# EAGLE design HVcontroller0_1 (EAGLE 6.5.0)

## Sheet 1 of 2: Processor/Controls
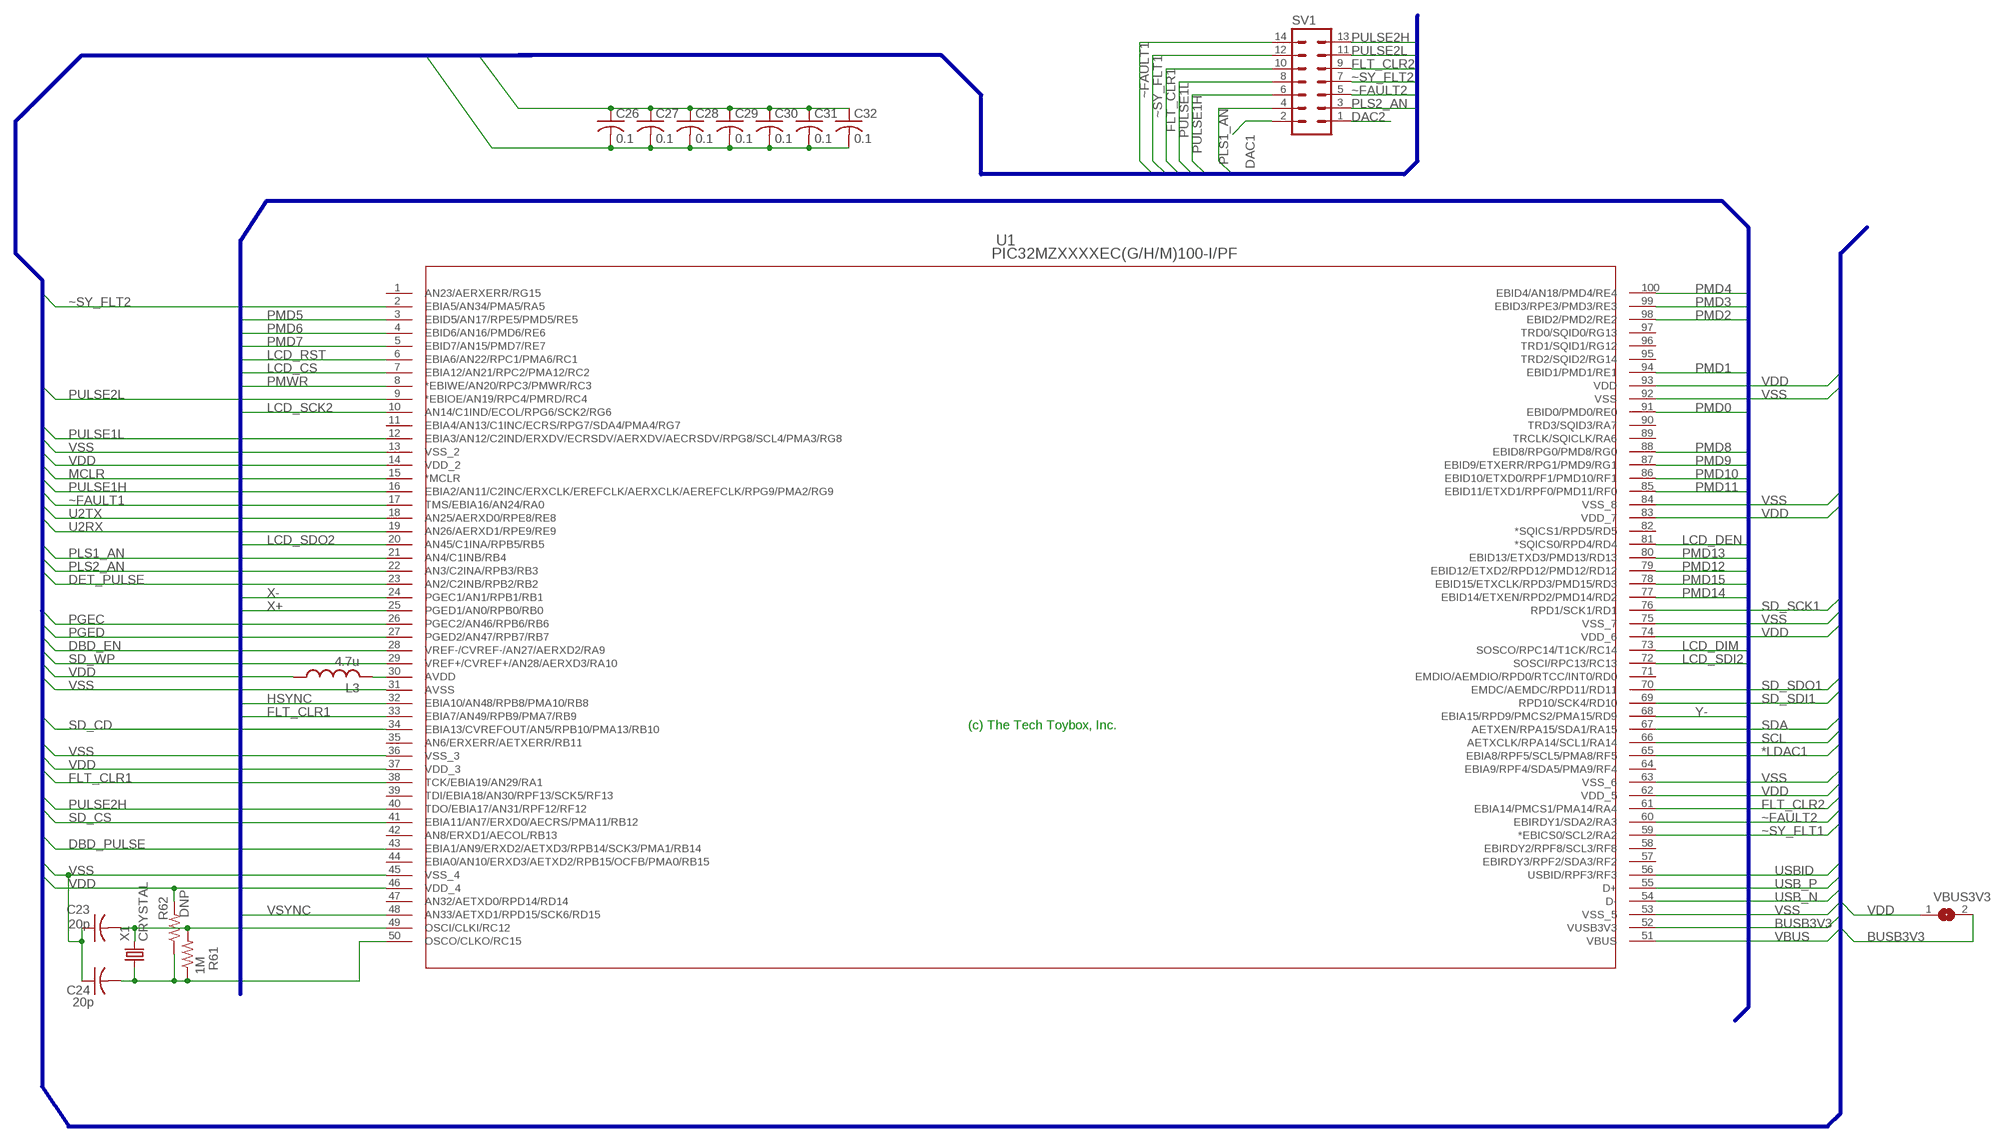
[diagram p0: schematic, sheet 1]

### Parts
C23  20p  C-USC0402  [C0402]
C24  20p  C-USC0402  [C0402]
C26  0.1  C-USC0603  [C0603]
C27  0.1  C-USC0603  [C0603]
C28  0.1  C-USC0603  [C0603]
C29  0.1  C-USC0603  [C0603]
C30  0.1  C-USC0603  [C0603]
C31  0.1  C-USC0603  [C0603]
C32  0.1  C-USC0603  [C0603]
L3  4.7u  L-USL2012C  [L2012C]
R61  1M  R-US_R0402  [R0402]
R62  DNP  R-US_R0402  [R0402]
SV1  MA07-2  [MA07-2]
U1  PIC32MZXXXXEC(G/H/M)100-I/PF  [TQFP100_14X14MC]
VBUS3V3  SJ  [SJ]
X1  CRYSTAL  [ABM]

### Nets
*LDAC1: U1.65(EBIA8/RPF5/SCL5/PMA8/RF5) ; also sheet 2
BUSB3V3: U1.52(VUSB3V3) VBUS3V3.2
DAC1: SV1.2 ; also sheet 2
DAC2: SV1.1 ; also sheet 2
DBD_EN: U1.28(VREF-/CVREF-/AN27/AERXD2/RA9)
DBD_PULSE: U1.43(EBIA1/AN9/ERXD2/AETXD3/RPB14/SCK3/PMA1/RB14)
DET_PULSE: U1.23(AN2/C2INB/RPB2/RB2) ; also sheet 2
FLT_CLR1: SV1.10 U1.38(TCK/EBIA19/AN29/RA1)
FLT_CLR2: SV1.9 U1.61(EBIA14/PMCS1/PMA14/RA4)
HSYNC: U1.32(EBIA10/AN48/RPB8/PMA10/RB8)
LCD_CS: U1.7(EBIA12/AN21/RPC2/PMA12/RC2)
LCD_DEN: U1.81(*SQICS0/RPD4/RD4)
LCD_DIM: U1.73(SOSCO/RPC14/T1CK/RC14)
LCD_RST: U1.6(EBIA6/AN22/RPC1/PMA6/RC1)
LCD_SCK2: U1.10(AN14/C1IND/ECOL/RPG6/SCK2/RG6)
LCD_SDI2: U1.72(SOSCI/RPC13/RC13)
LCD_SDO2: U1.20(AN45/C1INA/RPB5/RB5)
MCLR: U1.15(*MCLR) ; also sheet 2
N$93: L3.2 U1.30(AVDD)
N$107: C23.2 R61.2 U1.49(OSCI/CLKI/RC12) X1.P$2
N$108: C24.2 R61.1 R62.1 U1.50(OSCO/CLKO/RC15) X1.P$1
PGEC: U1.26(PGEC2/AN46/RPB6/RB6) ; also sheet 2
PGED: U1.27(PGED2/AN47/RPB7/RB7) ; also sheet 2
PLS1_AN: SV1.4 U1.21(AN4/C1INB/RB4)
PLS2_AN: SV1.3 U1.22(AN3/C2INA/RPB3/RB3)
PMD0: U1.91(EBID0/PMD0/RE0)
PMD1: U1.94(EBID1/PMD1/RE1)
PMD2: U1.98(EBID2/PMD2/RE2)
PMD3: U1.99(EBID3/RPE3/PMD3/RE3)
PMD4: U1.100(EBID4/AN18/PMD4/RE4)
PMD5: U1.3(EBID5/AN17/RPE5/PMD5/RE5)
PMD6: U1.4(EBID6/AN16/PMD6/RE6)
PMD7: U1.5(EBID7/AN15/PMD7/RE7)
PMD8: U1.88(EBID8/RPG0/PMD8/RG0)
PMD9: U1.87(EBID9/ETXERR/RPG1/PMD9/RG1)
PMD10: U1.86(EBID10/ETXD0/RPF1/PMD10/RF1)
PMD11: U1.85(EBID11/ETXD1/RPF0/PMD11/RF0)
PMD12: U1.79(EBID12/ETXD2/RPD12/PMD12/RD12)
PMD13: U1.80(EBID13/ETXD3/PMD13/RD13)
PMD14: U1.77(EBID14/ETXEN/RPD2/PMD14/RD2)
PMD15: U1.78(EBID15/ETXCLK/RPD3/PMD15/RD3)
PMWR: U1.8(*EBIWE/AN20/RPC3/PMWR/RC3)
PULSE1H: SV1.6 U1.16(EBIA2/AN11/C2INC/ERXCLK/EREFCLK/AERXCLK/AEREFCLK/RPG9/PMA2/RG9)
PULSE1L: SV1.8 U1.12(EBIA3/AN12/C2IND/ERXDV/ECRSDV/AERXDV/AECRSDV/RPG8/SCL4/PMA3/RG8)
PULSE2H: SV1.13 U1.40(TDO/EBIA17/AN31/RPF12/RF12)
PULSE2L: SV1.11 U1.9(*EBIOE/AN19/RPC4/PMRD/RC4)
SCL: U1.66(AETXCLK/RPA14/SCL1/RA14) ; also sheet 2
SD_CD: U1.34(EBIA13/CVREFOUT/AN5/RPB10/PMA13/RB10) ; also sheet 2
SD_CS: U1.41(EBIA11/AN7/ERXD0/AECRS/PMA11/RB12) ; also sheet 2
SD_SCK1: U1.76(RPD1/SCK1/RD1) ; also sheet 2
SD_SDI1: U1.69(RPD10/SCK4/RD10) ; also sheet 2
SD_SDO1: U1.70(EMDC/AEMDC/RPD11/RD11) ; also sheet 2
SD_WP: U1.29(VREF+/CVREF+/AN28/AERXD3/RA10) ; also sheet 2
SDA: U1.67(AETXEN/RPA15/SDA1/RA15) ; also sheet 2
U2RX: U1.19(AN26/AERXD1/RPE9/RE9) ; also sheet 2
U2TX: U1.18(AN25/AERXD0/RPE8/RE8) ; also sheet 2
USB_N: U1.54(D-) ; also sheet 2
USB_P: U1.55(D+) ; also sheet 2
USBID: U1.56(USBID/RPF3/RF3) ; also sheet 2
VBUS: U1.51(VBUS) ; also sheet 2
VDD: C26.1 C27.1 C28.1 C29.1 C30.1 C31.1 C32.1 L3.1 R62.2 U1.14(VDD_2) U1.37(VDD_3) U1.46(VDD_4) U1.62(VDD_5) U1.74(VDD_6) U1.83(VDD_7) U1.93(VDD) VBUS3V3.1 ; also sheet 2
VSS: C23.1 C24.1 C26.2 C27.2 C28.2 C29.2 C30.2 C31.2 C32.2 U1.13(VSS_2) U1.31(AVSS) U1.36(VSS_3) U1.45(VSS_4) U1.53(VSS_5) U1.63(VSS_6) U1.75(VSS_7) U1.84(VSS_8) U1.92(VSS) ; also sheet 2
VSYNC: U1.48(AN33/AETXD1/RPD15/SCK6/RD15)
X+: U1.25(PGED1/AN0/RPB0/RB0)
X-: U1.24(PGEC1/AN1/RPB1/RB1)
Y+: U1.33(EBIA7/AN49/RPB9/PMA7/RB9)
Y-: U1.68(EBIA15/RPD9/PMCS2/PMA15/RD9)
~FAULT1: SV1.14 U1.17(TMS/EBIA16/AN24/RA0)
~FAULT2: SV1.5 U1.60(EBIRDY1/SDA2/RA3)
~SY_FLT1: SV1.12 U1.59(*EBICS0/SCL2/RA2)
~SY_FLT2: SV1.7 U1.2(EBIA5/AN34/PMA5/RA5)
Unconnected: U1.1(AN23/AERXERR/RG15) U1.11(EBIA4/AN13/C1INC/ECRS/RPG7/SDA4/PMA4/RG7) U1.35(AN6/ERXERR/AETXERR/RB11) U1.39(TDI/EBIA18/AN30/RPF13/SCK5/RF13) U1.42(AN8/ERXD1/AECOL/RB13) U1.44(EBIA0/AN10/ERXD3/AETXD2/RPB15/OCFB/PMA0/RB15) U1.47(AN32/AETXD0/RPD14/RD14) U1.57(EBIRDY3/RPF2/SDA3/RF2) U1.58(EBIRDY2/RPF8/SCL3/RF8) U1.64(EBIA9/RPF4/SDA5/PMA9/RF4) U1.71(EMDIO/AEMDIO/RPD0/RTCC/INT0/RD0) U1.82(*SQICS1/RPD5/RD5) U1.89(TRCLK/SQICLK/RA6) U1.90(TRD3/SQID3/RA7) U1.95(TRD2/SQID2/RG14) U1.96(TRD1/SQID1/RG12) U1.97(TRD0/SQID0/RG13)

### Buses
PULSE1H,PULSE1L,~FAULT1,~SY_FLT1,FLT_CLR1,PLS1_AN,PULSE2H,PULSE2L,~FAULT2,~SY_FLT2,FLT_CLR2,PLS2_AN,SCL,SDA,*LDAC1,RDY1,DBD_EN,DBD_PULSE,DBD_AN,MCLR,PGED,PGEC,USB_N,USB_P,VBUS,BUSB3V3,USBID,U2TX,U2RX,DET_PULSE,SD_WP,SD_CS,SD_SDI1,SD_SDO1,SD_SCK1,SD_CD,VDD,VSS
PMD[0..15],LCD_DEN,LCD_DIM,Y+,Y-,X+,X-,HSYNC,VSYNC,LCD_SDI2,LCD_SDO2,LCD_SCK2,LCD_RST,LCD_CS,PMWR

### Notes on the sheet
- (c) The Tech Toybox, Inc.

## Sheet 2 of 2
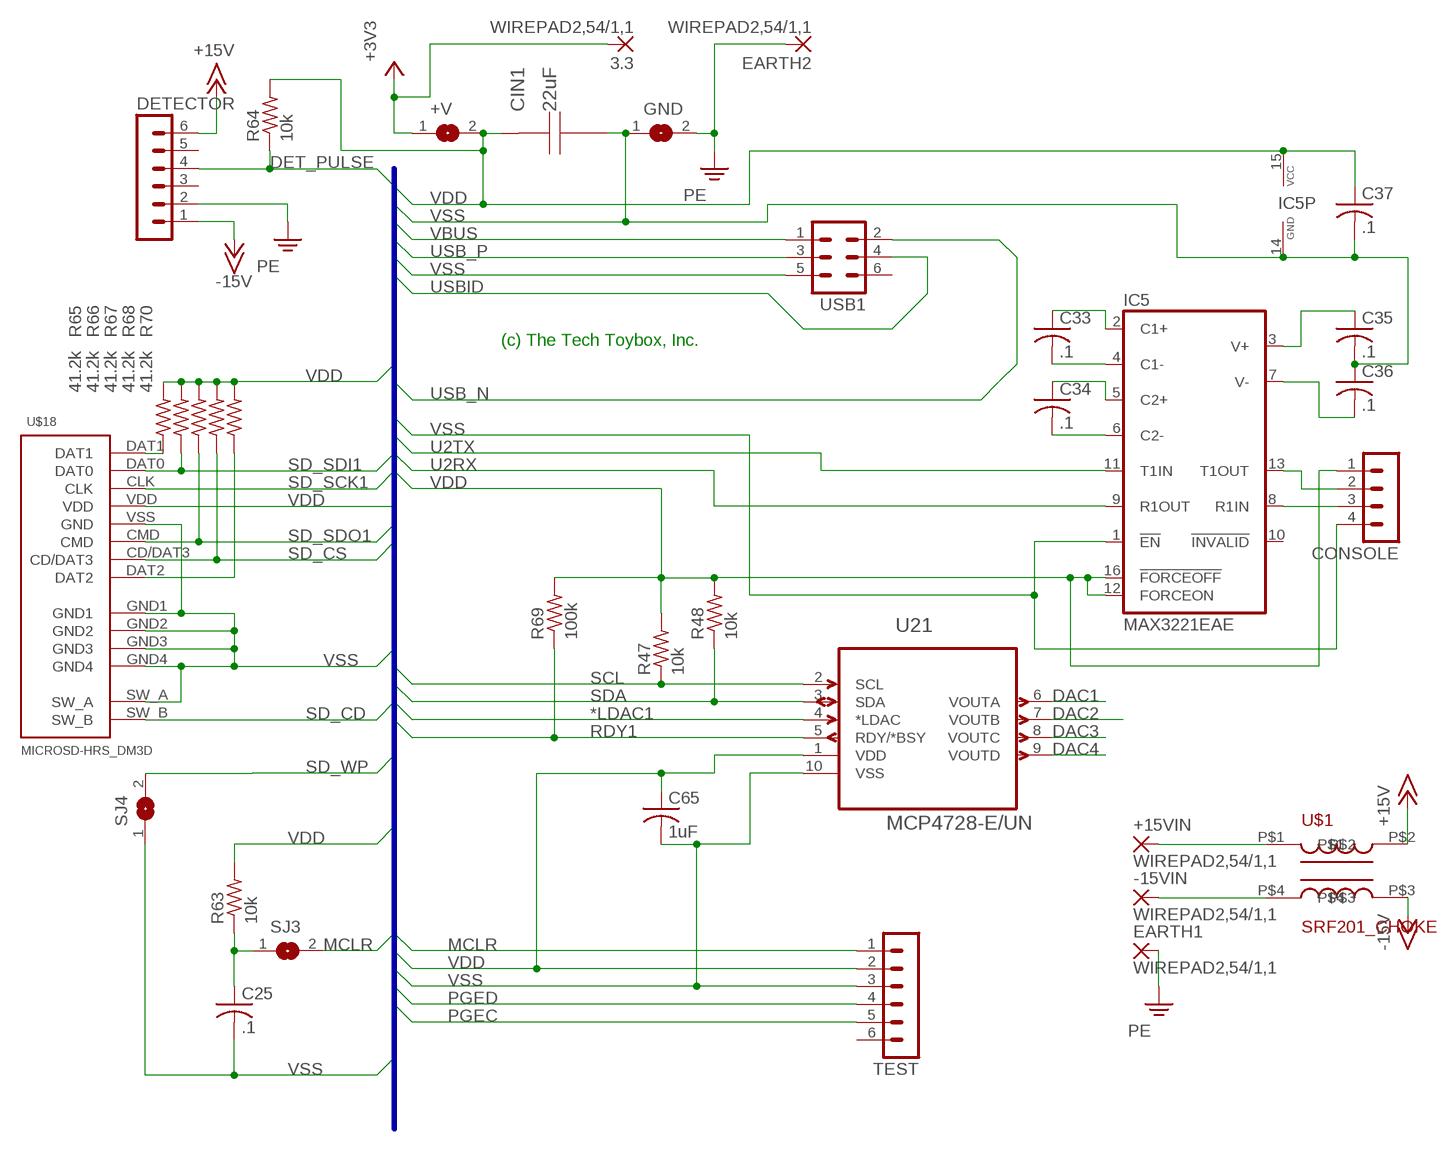
[diagram p1: schematic, sheet 2]

### Parts
3.3  WIREPAD2,54/1,1  [2,54/1,1]
+15VIN  WIREPAD2,54/1,1  [2,54/1,1]
+V  SJW  [SJW]
-15VIN  WIREPAD2,54/1,1  [2,54/1,1]
C25  .1  C-USC0402  [C0402]
C33  .1  C-USC0402  [C0402]
C34  .1  C-USC0402  [C0402]
C35  .1  C-USC0402  [C0402]
C36  .1  C-USC0402  [C0402]
C37  .1  C-USC0402  [C0402]
C65  1uF  C-USC0402  [C0402]
CIN1  22uF  GRM32ER61E226KE15L  [1210]
CONSOLE  MA04-1  [MA04-1]
DETECTOR  MA06-1  [MA06-1]
EARTH1  WIREPAD2,54/1,1  [2,54/1,1]
EARTH2  WIREPAD2,54/1,1  [2,54/1,1]
GND  SJW  [SJW]
IC5  MAX3221EAE  [SSOP16]
R47  10k  R-US_R0805  [R0805]
R48  10k  R-US_R0805  [R0805]
R63  10k  R-US_R0805  [R0805]
R64  10k  R-US_R0805  [R0805]
R65  41.2k  R-US_R0603  [R0603]
R66  41.2k  R-US_R0603  [R0603]
R67  41.2k  R-US_R0603  [R0603]
R68  41.2k  R-US_R0603  [R0603]
R69  100k  R-US_R0805  [R0805]
R70  41.2k  R-US_R0603  [R0603]
SJ3  SJ  [SJ]
SJ4  SJ  [SJ]
TEST  MA06-1  [MA06-1]
U21  MCP4728-E/UN  [SOP50P490X110-10N]
U$1  SRF201_CHOKE  [CHOKE_BOURNES_SRF2012]
U$18  MICROSD-HRS_DM3D  [DM3D]
USB1  MA03-2  [MA03-2]

### Nets
*LDAC1: U21.4(*LDAC) ; also sheet 1
+3V3: 3.3.1(P) +V.1
+15V: DETECTOR.6 U$1.P$2
-15V: DETECTOR.1 U$1.P$3
DAC1: U21.6(VOUTA) ; also sheet 1
DAC2: U21.7(VOUTB) ; also sheet 1
DAC3: U21.8(VOUTC)
DAC4: U21.9(VOUTD)
DET_PULSE: DETECTOR.4 R64.1 ; also sheet 1
MCLR: SJ3.2 TEST.1 ; also sheet 1
N$1: -15VIN.1(P) U$1.P$4
N$2: +15VIN.1(P) U$1.P$1
N$28: R65.1 U$18.DAT1
N$49: R70.1 U$18.DAT2
N$92: C33.1 IC5.2(C1+)
N$102: C25.1 R63.1 SJ3.1
N$109: C33.2 IC5.4(C1-)
N$110: C34.1 IC5.5(C2+)
N$111: C34.2 IC5.6(C2-)
N$112: C35.1 IC5.3(V+)
N$113: C36.2 IC5.7(V-)
N$116: CONSOLE.2 IC5.13(T1OUT)
N$117: CONSOLE.3 IC5.8(R1IN)
PE: DETECTOR.2 EARTH1.1(P) EARTH2.1(P) GND.2
PGEC: TEST.5 ; also sheet 1
PGED: TEST.4 ; also sheet 1
RDY1: R69.1 U21.5(RDY/*BSY)
SCL: R47.1 U21.2(SCL) ; also sheet 1
SD_CD: U$18.SW_B ; also sheet 1
SD_CS: R68.1 U$18.CD/DAT3 ; also sheet 1
SD_SCK1: U$18.CLK ; also sheet 1
SD_SDI1: R66.1 U$18.DAT0 ; also sheet 1
SD_SDO1: R67.1 U$18.CMD ; also sheet 1
SD_WP: SJ4.2 ; also sheet 1
SDA: R48.1 U21.3(SDA) ; also sheet 1
U2RX: IC5.9(R1OUT) ; also sheet 1
U2TX: IC5.11(T1IN) ; also sheet 1
USB_N: USB1.2 ; also sheet 1
USB_P: USB1.3 ; also sheet 1
USBID: USB1.4 ; also sheet 1
VBUS: USB1.1 ; also sheet 1
VDD: +V.2 C37.1 C65.1 CIN1.1 CONSOLE.1 IC5.12(FORCEON) IC5.15(VCC) IC5.16(!FORCEOFF) R47.2 R48.2 R63.2 R64.2 R65.2 R66.2 R67.2 R68.2 R69.2 R70.2 TEST.2 U21.1(VDD) U$18.VDD ; also sheet 1
VSS: C25.2 C35.2 C36.1 C37.2 C65.2 CIN1.2 CONSOLE.4 GND.1 IC5.1(!EN) IC5.14(GND) SJ4.1 TEST.3 U21.10(VSS) U$18.GND1 U$18.GND2 U$18.GND3 U$18.GND4 U$18.SW_A U$18.VSS(GND) USB1.5 ; also sheet 1
Unconnected: DETECTOR.3 DETECTOR.5 IC5.10(!INVALID) TEST.6 USB1.6

### Buses
PULSE1H,PULSE1L,~FAULT1,~SY_FLT1,FLT_CLR1,PLS1_AN,PULSE2H,PULSE2L,~FAULT2,~SY_FLT2,FLT_CLR2,PLS2_AN,SCL,SDA,*LDAC1,RDY1,DBD_EN,DBD_PULSE,DBD_AN,MCLR,PGED,PGEC,USB_N,USB_P,VBUS,BUSB3V3,USBID,U2TX,U2RX,DET_PULSE,SD_WP,SD_CS,SD_SDI1,SD_SDO1,SD_SCK1,SD_CD,VDD,VSS

### Notes on the sheet
- (c) The Tech Toybox, Inc.

## Library data of the parts
3.3 +15VIN -15VIN EARTH1 EARTH2 = wirepad:WIREPAD: Wire PAD connect wire on PCB
+V GND SJ3 SJ4 VBUS3V3 = jumper:SJ: SMD solder JUMPER
C23-C37 C65 = rcl:C-US: CAPACITOR, American symbol
CIN1 = workbookdesign0823:GRM32ER61E226KE15L; CAP: 2.2E-5; ESR: 0.0020; IRMS: 0.0; MANUFACTURER_NAME: MuRata; MANUFACTURER_PART_NUMBER: GRM32ER61E226KE15L; VDC: 25.0; VENDOR: MuRata
CONSOLE = UserMark (mark-Hi-Fi-A85W's conflicted copy 2016-02-01):MA04-1: PIN HEADER; OC_FARNELL: unknown; OC_NEWARK: unknown
DETECTOR TEST = UserMark (mark-Hi-Fi-A85W's conflicted copy 2016-02-01):MA06-1: PIN HEADER; OC_FARNELL: unknown; OC_NEWARK: unknown
IC5 = maxim:MAX3221*: RS-232 Transceivers with AutoShutdown 1µA Supply-Current, True +3V to +5.5V http://dbserv.maxim-ic.com/; MF: MAXIM; MPN: MAX3221EAE+; OC_FARNELL: 9725440; OC_NEWARK: 68K4609
L3 = rcl:L-US: INDUCTOR, American symbol
R47 R48 R61-R70 = rcl:R-US_: RESISTOR, American symbol
SV1 = UserMark:MA07-2: PIN HEADER; OC_FARNELL: unknown; OC_NEWARK: unknown
U1 = UserMark:PIC32MZXXXXEC(G/H/M)100-I/PF; MANUFACTURER_PART_NUMBER: pic32mz1024ecg100-i/pf; VENDOR: Microchip
U21 = Microchip_By_element14_Batch_1:MCP4728-E/UN: IC, DAC, 12BIT, QUAD; MPN: MCP4728-E/UN; OC_FARNELL: 1800217; OC_NEWARK: 08R1808; PACKAGE: MSOP-10; SUPPLIER: MICROCHIP
U$1 = UserMark:SRF201_CHOKE
U$18 = hrs_DM3D-SF:MICROSD-HRS_DM3D
USB1 = UserMark:MA03-2: PIN HEADER; OC_FARNELL: unknown; OC_NEWARK: unknown
X1 = UserMark:CRYSTAL

## Board
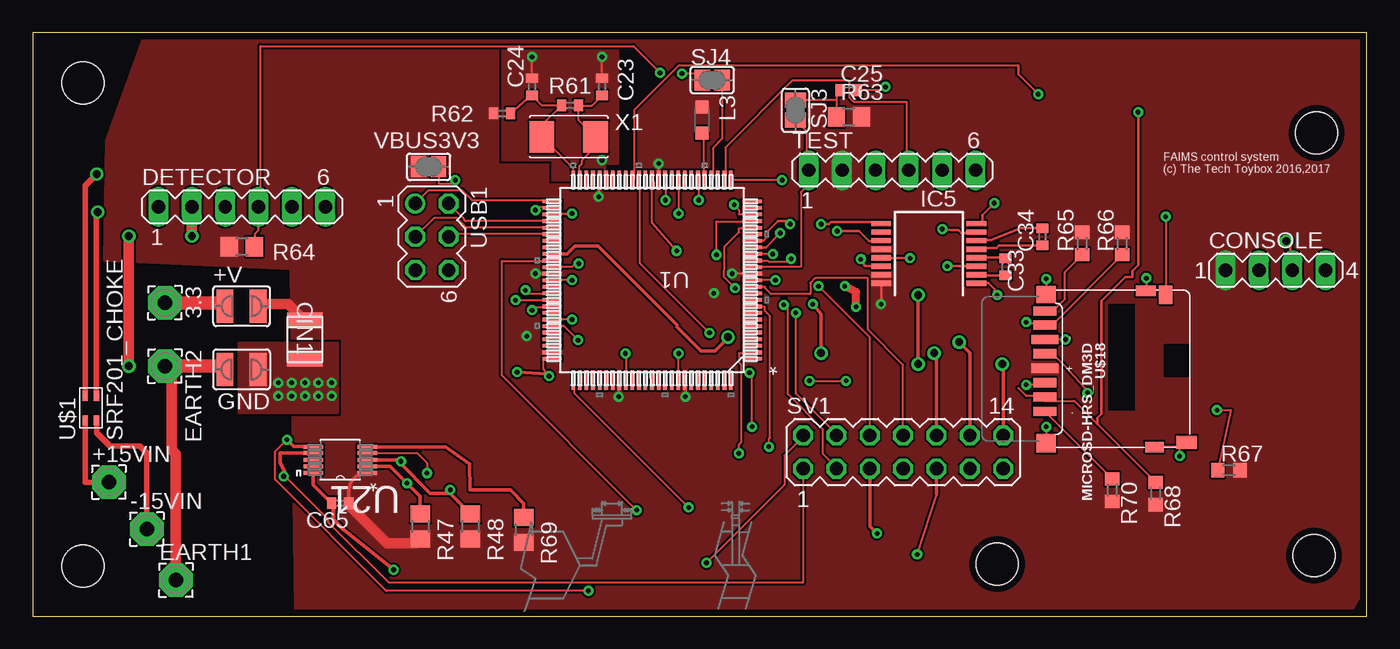
[diagram p2: board, top side]
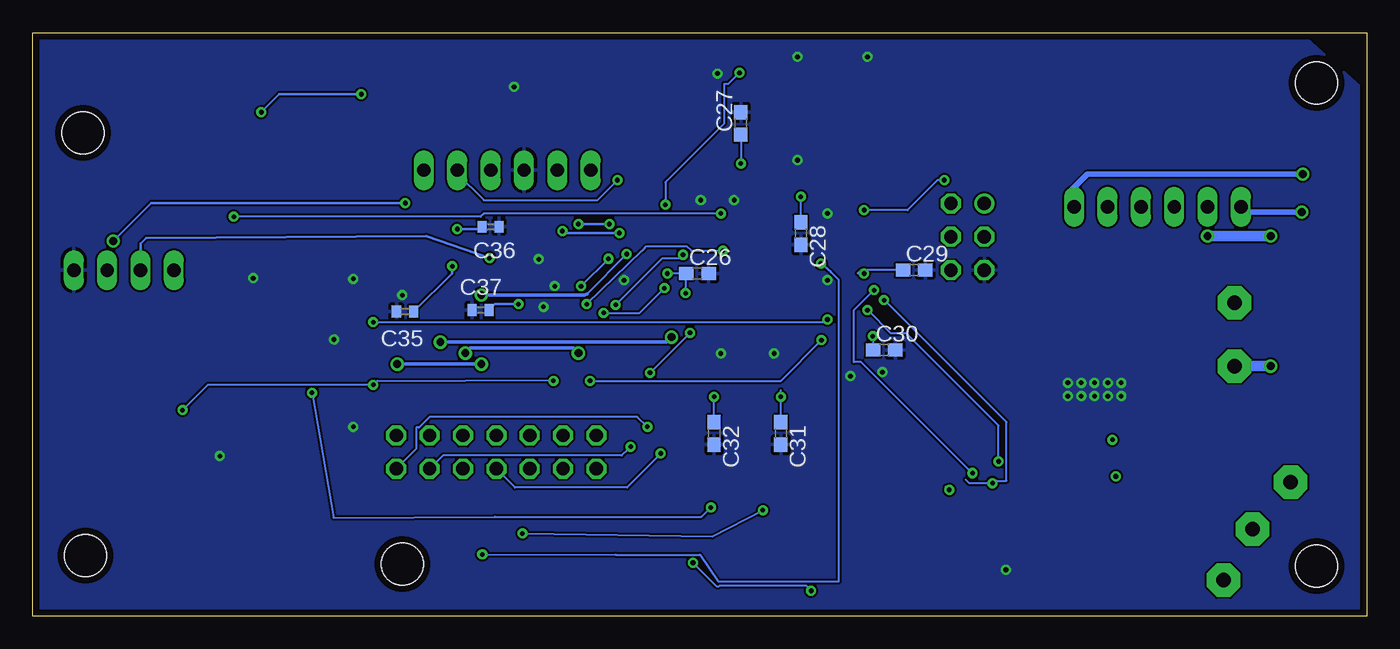
[diagram p3: board, bottom side, seen from below]

Size 101.6 x 44.45 mm. Coordinates in mm from the lower left corner, seen from the top.
Outline: 0,0 101.6,0 101.6,44.45 0,44.45 0,0
Copper layers (1*16): Top 0.0178mm / dielectric 59mil / Bottom 0.0178mm
Design rules "SSC-EAGLE-2Lyr_v1.0.0.3": minimum track width 6mil, minimum drill 14mil, track to track 6mil, track to pad 6mil, pad to pad 6mil, via to via 6mil, smd to smd 6mil, copper to edge 20mil, drill to drill 16mil, minimum pad ring 8mil, minimum via ring 8mil, stop-mask expansion 3mil, vias tented up to drill 0mil, thermal gap 10mil
Holes 3.2 mm at 3.81,40.64 3.81,3.81 97.79,36.83 73.46,3.96 97.59,4.62

### Footprints (pad centres in the part's own frame; a part is rotated, then mirrored left to right if it is on the bottom)
2,54/1,1 = drill 1.118 pad 2.54 octagon: 1 0,0
SJW = smd 1.27 x 2.54: 1 -1.27,0; 2 1.27,0
C0402 = smd 0.7 x 0.9: 1 -0.65,0; 2 0.65,0
C0603 = smd 1.1 x 1: 1 -0.85,0; 2 0.85,0
1210 = smd 1.118 x 2.692: 1 -1.499,0; 2 1.499,0
MA04-1 = drill 1.016 long: 1 -3.81,0; 2 -1.27,0; 3 1.27,0; 4 3.81,0
MA06-1 = drill 1.016 long: 1 -6.35,0; 2 -3.81,0; 3 -1.27,0; 4 1.27,0; 5 3.81,0; 6 6.35,0
SSOP16 = smd 0.4 x 1.5: 1 -2.275,-3.625; 2 -1.625,-3.625; 3 -0.975,-3.625; 4 -0.325,-3.625; 5 0.325,-3.625; 6 0.975,-3.625; 7 1.625,-3.625; 8 2.275,-3.625; 9 2.275,3.625; 10 1.625,3.625; 11 0.975,3.625; 12 0.325,3.625; 13 -0.325,3.625; 14 -0.975,3.625; 15 -1.625,3.625; 16 -2.275,3.625
L2012C = smd 1 x 1: 1 -1,0; 2 1,0
R0805 = smd 1.3 x 1.5: 1 -0.95,0; 2 0.95,0
R0402 = smd 0.7 x 0.9: 1 -0.65,0; 2 0.65,0
R0603 = smd 1 x 1.1: 1 -0.85,0; 2 0.85,0
SJ = smd 1.168 x 1.6: 1 -0.762,0; 2 0.762,0
MA07-2 = drill 1.016 octagon: 1 -7.62,-1.27; 2 -7.62,1.27; 3 -5.08,-1.27; 4 -5.08,1.27; 5 -2.54,-1.27; 6 -2.54,1.27; 7 0,-1.27; 8 0,1.27; 9 2.54,-1.27; 10 2.54,1.27; 11 5.08,-1.27; 12 5.08,1.27; 13 7.62,-1.27; 14 7.62,1.27
TQFP100_14X14MC = smd 1.473 x 0.279: 1 -7.62,5.994; 2 -7.62,5.512; 3 -7.62,5.004; 4 -7.62,4.496; 5 -7.62,3.988; 6 -7.62,3.505; 7 -7.62,2.997; 8 -7.62,2.489; 9 -7.62,2.007; 10 -7.62,1.499; 11 -7.62,0.991; 12 -7.62,0.508; 13 -7.62,0; 14 -7.62,-0.508; 15 -7.62,-0.991; 16 -7.62,-1.499; 17 -7.62,-2.007; 18 -7.62,-2.489; 19 -7.62,-2.997; 20 -7.62,-3.505; 21 -7.62,-3.988; 22 -7.62,-4.496; 23 -7.62,-5.004; 24 -7.62,-5.512; 25 -7.62,-5.994; 51 7.62,-5.994; 52 7.62,-5.512; 53 7.62,-5.004; 54 7.62,-4.496; 55 7.62,-3.988; 56 7.62,-3.505; 57 7.62,-2.997; 58 7.62,-2.489; 59 7.62,-2.007; 60 7.62,-1.499; 61 7.62,-0.991; 62 7.62,-0.508; 63 7.62,0; 64 7.62,0.508; 65 7.62,0.991; 66 7.62,1.499; 67 7.62,2.007; 68 7.62,2.489; 69 7.62,2.997; 70 7.62,3.505; 71 7.62,3.988; 72 7.62,4.496; 73 7.62,5.004; 74 7.62,5.512; 75 7.62,5.994 | smd 0.279 x 1.473: 26 -5.994,-7.62; 27 -5.512,-7.62; 28 -5.004,-7.62; 29 -4.496,-7.62; 30 -3.988,-7.62; 31 -3.505,-7.62; 32 -2.997,-7.62; 33 -2.489,-7.62; 34 -2.007,-7.62; 35 -1.499,-7.62; 36 -0.991,-7.62; 37 -0.508,-7.62; 38 0,-7.62; 39 0.508,-7.62; 40 0.991,-7.62; 41 1.499,-7.62; 42 2.007,-7.62; 43 2.489,-7.62; 44 2.997,-7.62; 45 3.505,-7.62; 46 3.988,-7.62; 47 4.496,-7.62; 48 5.004,-7.62; 49 5.512,-7.62; 50 5.994,-7.62; 76 5.994,7.62; 77 5.512,7.62; 78 5.004,7.62; 79 4.496,7.62; 80 3.988,7.62; 81 3.505,7.62; 82 2.997,7.62; 83 2.489,7.62; 84 2.007,7.62; 85 1.499,7.62; 86 0.991,7.62; 87 0.508,7.62; 88 0,7.62; 89 -0.508,7.62; 90 -0.991,7.62; 91 -1.499,7.62; 92 -2.007,7.62; 93 -2.489,7.62; 94 -2.997,7.62; 95 -3.505,7.62; 96 -3.988,7.62; 97 -4.496,7.62; 98 -5.004,7.62; 99 -5.512,7.62; 100 -5.994,7.62
SOP50P490X110-10N = smd 1.499 x 0.305: 1 -2.057,0.991; 2 -2.057,0.508; 3 -2.057,0; 4 -2.057,-0.508; 5 -2.057,-0.991; 6 2.057,-0.991; 7 2.057,-0.508; 8 2.057,0; 9 2.057,0.508; 10 2.057,0.991
CHOKE_BOURNES_SRF2012 = smd 0.749 x 0.394: P$1 -0.922,0.427; P$2 0.922,0.427; P$3 0.922,-0.427; P$4 -0.922,-0.427
DM3D = smd 0.7 x 1.75: CD/DAT3 8.15,0.45; CLK 4.85,0.45; CMD 7.05,0.45; DAT0 2.65,0.45; DAT1 1.6,0.45; DAT2 9.25,0.45 | smd 0.8 x 1.5: GND1 0.05,8.15 | smd 0.8 x 1.4: GND2 11.95,8.8 | smd 1.4 x 1.5: GND3 11.65,0.55 | smd 1.3 x 1.5: GND4 0.35,0.55 | smd 1 x 1.55: SW_A 11.6,11.25 | smd 1.4 x 1: SW_B 0.35,9.65 | smd 0.7 x 2.032: VDD 5.95,0.45; VSS 3.75,0.45
MA03-2 = drill 1.016: 1 -2.54,-1.27 | drill 1.016 octagon: 2 -2.54,1.27; 3 0,-1.27; 4 0,1.27; 5 2.54,-1.27; 6 2.54,1.27
ABM = smd 1.9 x 2.4: P$1 -2.05,0; P$2 2.05,0

### Placement (x,y rotation side)
3.3  10.06,23.88 270 top
+15VIN  5.79,10.21 0 top
+V  15.9,23.62 0 top
-15VIN  8.69,6.63 0 top
C23  43.36,40.34 270 top
C24  38.02,40.34 270 top
C25  62.15,40.08 0 top
C26  50.98,26.11 0 bottom
C27  47.68,37.54 90 bottom
C28  43.1,29.16 270 bottom
C29  34.47,26.37 0 bottom
C30  36.75,20.27 0 bottom
C31  44.63,13.92 270 bottom
C32  49.71,13.92 270 bottom
C33  74.09,26.62 90 top
C34  76.89,28.91 90 top
C35  73.25,23.22 180 bottom
C36  66.73,29.67 180 bottom
C37  67.49,23.32 180 bottom
C65  23.42,8.61 180 top
CIN1  20.73,21.08 270 top
CONSOLE  94.67,26.37 0 top
DETECTOR  15.93,31.19 0 top
EARTH1  10.9,2.74 0 top
EARTH2  10.06,19.05 270 top
GND  15.9,18.8 180 top
IC5  68.25,27.64 90 top
L3  50.98,37.8 270 top
R47  29.51,6.83 270 top
R48  33.32,6.83 270 top
R61  40.92,38.91 0 top
R62  35.74,38.3 180 top
R63  62.15,38.05 0 top
R64  15.93,28.14 180 top
R65  79.93,28.4 90 top
R66  82.98,28.4 90 top
R67  91.11,11.13 0 top
R68  85.52,9.35 270 top
R69  37.39,6.58 270 top
R70  82.22,9.6 270 top
SJ3  58.09,38.56 270 top
SJ4  51.74,40.84 0 top
SV1  66.29,12.5 0 top
TEST  65.46,33.99 0 top
U1  47.17,25.6 180 top
U21  23.42,11.91 180 top
U$1  4.42,15.85 90 top
U$18  76.63,24.84 270 top
USB1  30.4,28.91 270 top
VBUS3V3  30.15,34.24 0 top
X1  40.82,36.53 0 top

### Tracks (layer width: path | path; a pad name or v marks a point on that pad's centre or on a via)
*LDAC1  (via drill 0.36)
  Top 0.152: U21.4 25.7,12.42 29.26,12.42 30.02,11.66 v30.02,10.9 | 37.52,24.59 v37.52,24.84 37.52,24.59 | 37.52,24.59 39.55,24.59 U1.65
  Bottom 0.152: v37.52,24.84 37.54,24.84 39.06,23.32 39.06,19.36 38.51,19.36 30.07,10.92 30.02,10.92 v30.02,10.9
+3V3
  Top 1.016: 3.3.1 14.38,23.88 +V.1
+15V  (via drill 0.6)
  Top 0.406: U$1.P$2 3.99,32.8 v4.88,33.68
  Bottom 0.406: v4.88,33.68 21.26,33.68 22.4,32.54 22.4,31.32 DETECTOR.6
-15V  (via drill 0.6)
  Top 0.406: U$1.P$3 4.85,30.68 v4.95,30.79
  Bottom 0.406: v4.95,30.79 9.17,30.79 DETECTOR.1
BUSB3V3  (via drill 0.36)
  Top 0.152: v32.18,33.22 31.93,32.97 30.91,32.97 VBUS3V3.2 | v38.28,30.94 38.28,31.19 39.55,31.19 U1.52
  Bottom 0.152: v38.28,30.94 34.98,30.94 32.69,33.22 v32.18,33.22
DAC1  (via drill 0.36)
  Top 0.152: v42.32,1.93 26.92,1.93 18.44,10.41 18.44,12.55 19.25,13.36 v19.36,13.44 | v51.31,4.06 57.25,10.01 57.25,12.24 58.67,13.66 SV1.2
  Top 0.254: v19.36,13.44 19.86,12.93 21.13,12.93 U21.6
  Bottom 0.152: v42.32,1.93 42.72,2.34 49.28,2.34 49.33,2.29 49.53,2.29 v51.31,4.06
DAC2  (via drill 0.36)
  Top 0.152: SV1.1 58.67,2.54 27.13,2.54 22.5,7.16 22.5,7.37 19.36,10.52 v19.1,10.64
  Top 0.254: v19.1,10.64 19.36,10.64 18.85,11.66 18.85,12.42 21.13,12.42 U21.7
DET_PULSE  (via drill 0.36)
  Top 0.152: R64.1 16.94,28.14 16.94,29.16 17.2,29.41 DETECTOR.4 17.25,31.24 17.35,31.34 17.35,43.43 45.74,43.43 v47.78,41.4 | v53.42,31.34 53.42,31.29 53.77,30.94 53.77,30.63 54.79,30.63 U1.23
  Bottom 0.152: v53.42,31.34 53.42,33.07 48.95,37.54 48.95,40.54 48.64,40.54 v47.78,41.4
FLT_CLR1  (via drill 0.36, 0.6)
  Top 0.152: U1.38 47.17,29.97 v49.05,27.84
  Top 0.254: SV1.10 68.81,13.79 68.81,19.96 68.73,20.04 v68.66,20.04 | v60.05,20.04 60.05,23.01 v59.41,23.77
  Bottom 0.152: v49.05,27.84 51.44,27.84 51.79,28.19 54.84,28.19 55.09,27.94 55.19,27.84 v59.41,23.77
  Bottom 0.254: v68.66,20.04 68.28,20.42 60.43,20.42 v60.05,20.04
FLT_CLR2  (via drill 0.36)
  Top 0.152: v41.58,26.87 41.33,26.87 41.07,26.62 39.55,26.62 U1.61 | 68.81,9.27 v67.36,4.7
  Top 0.254: SV1.9 68.81,11.2 68.81,9.3 68.81,9.27
  Bottom 0.152: v41.58,26.87 40.82,26.21 40.21,25.6 40.21,2.64 49.4,2.64 50.8,4.67 57.2,4.67 v67.36,4.7
MCLR
  Top 0.152: U1.15 54.79,26.62 58.5,26.62 58.5,32.31 59.11,32.92 TEST.1 59.05,34.04 58.95,34.14 58.95,36.93 SJ3.2
N$1
  Top 0.406: -15VIN.1 8.69,12.42 8.15,12.95 5.87,12.95 4.88,13.95 4.88,14.9 U$1.P$4
N$2
  Top 0.406: +15VIN.1 3.99,10.21 U$1.P$1
N$28
  Top 0.152: R65.1 79.93,27.53 78.61,26.21 78.61,24.18 77.7,23.27 77.09,23.27 U$18.DAT1
N$49
  Top 0.152: R70.1 82.22,10.46 U$18.DAT2
N$92
  Top 0.178: IC5.2 71.92,25.97 C33.1
N$93
  Top 0.152: L3.2 50.98,36.78 51.13,36.63 51.13,33.22 U1.30
N$102
  Top 0.152: 61.24,39.32 61.24,38.05 R63.1 | 61.24,39.32 61.24,39.83 C25.1 | SJ3.1 61.19,39.32 61.24,39.32
N$107
  Top 0.152: U1.49 41.66,34.31 41.83,34.49 41.83,34.75 42.85,35.76 42.85,36.51 X1.P$2 42.85,36.52 41.58,37.8 R61.2 42.59,38.91 C23.2
N$108
  Top 0.152: U1.50 41.17,34.12 X1.P$1 38.77,37.41 R61.1 38.8,38.91 C24.2 37.99,39.69 R62.1
N$109
  Top 0.178: C33.2 74.05,27.31 IC5.4
N$110
  Top 0.178: IC5.5 71.96,28.04 73.38,28.04 73.59,28.25 C34.1
N$111
  Top 0.178: IC5.6 71.92,28.65 72.97,28.65 75.25,29.55 C34.2
N$112  (via drill 0.36)
  Top 0.178: v69.65,26.67 v69.66,26.66 IC5.3
  Bottom 0.178: C35.1 69.65,26.1 v69.65,26.67
N$113  (via drill 0.36)
  Top 0.178: IC5.7 71.86,29.26 71.09,29.26 71.02,29.18 70.71,29.18 70.48,29.41 70.03,29.41 69.95,29.41 v69.27,29.49
  Bottom 0.178: v69.27,29.49 67.36,29.49 67.36,29.64 C36.2
N$116  (via drill 0.36)
  Top 0.178: IC5.13 64.66,27.28 v66.83,27.28
  Bottom 0.178: v66.83,27.28 71.63,28.96 92.96,28.8 93.4,28.37 CONSOLE.2
N$117  (via drill 0.36, 0.6)
  Top 0.178: IC5.8 71.93,29.95 72.31,29.95 72.31,30.56 72.92,31.17 v73.23,31.47 | v95.48,28.57 95.48,28.42 95.78,28.12 95.78,27.89 95.94,27.74 CONSOLE.3
  Bottom 0.178: v73.23,31.47 92.58,31.47 v95.48,28.57
PE  (via drill 0.6)
  Top 0.813: v7.32,19.05 7.32,19.58 v7.32,28.96 | v12.12,28.96 12.12,31.17 DETECTOR.2 | EARTH1.1 10.9,12.34 10.59,12.65 10.59,18.59 EARTH2.1
  Top 1.016: EARTH2.1 14.38,19.05 GND.2
  Bottom 0.813: EARTH2.1 v7.32,19.05 | v12.12,28.96 v7.32,28.96
PGEC  (via drill 0.36)
  Top 0.152: v57.07,33.22 U1.26
  Bottom 0.152: v57.07,33.22 58.6,31.7 67.23,31.7 69.27,33.73 TEST.5
PGED
  Top 0.152: TEST.4 66.57,34.14 66.57,39.17 62.56,39.17 62.2,39.52 62.2,40.79 57.84,40.79 52.76,35.71 52.76,33.27 52.7,33.22 U1.27
PLS1_AN  (via drill 0.36)
  Top 0.152: v53.49,24.99 52.63,25.86 52.63,26.36 52.68,26.42 52.68,28.14 53.8,29.26 53.8,29.57 54.76,29.57 U1.21 | v58.12,23.11 58.12,16.97 61.21,13.87 SV1.4
  Bottom 0.152: v53.49,24.99 55.37,23.11 v58.12,23.11
PLS2_AN  (via drill 0.36)
  Top 0.152: v52.07,27.53 52.07,30.07 54.76,30.07 U1.22 | v57.2,23.72 57.51,23.42 57.51,16.92 60.2,14.22 60.2,12.34 61.21,11.33 SV1.3
  Bottom 0.152: v52.07,27.53 52.32,27.28 53.65,27.28 v57.2,23.72
PULSE1H  (via drill 0.36)
  Top 0.152: v57.76,27.23 57.76,26.98 56.08,26.98 55.98,27.08 54.81,27.08 U1.16 | v59.84,25.15 63.75,21.23 SV1.6
  Bottom 0.152: v59.84,25.15 v57.76,27.23
PULSE1L
  Top 0.152: SV1.8 66.29,19.15 63.6,21.84 63.6,25.76 59.59,25.76 59.23,25.4 59.23,24.54 56.24,24.54 55.78,24.99 55.78,25.09 54.81,25.09 U1.12
PULSE2H  (via drill 0.36)
  Top 0.152: v51.54,21.59 46.25,26.87 46.25,33.17 46.2,33.22 U1.40 | 54.84,18.29 v54.59,18.54 54.79,18.34 v54.79,14.43
  Bottom 0.152: v54.59,18.54 v51.54,21.59 | SV1.13 72.39,12.75 72.39,14.38 72.19,14.38 71.37,15.19 55.58,15.19 54.86,14.48 54.81,14.48 v54.79,14.43
PULSE2L  (via drill 0.36)
  Top 0.152: U1.9 54.79,23.57 55.75,23.57 55.75,23.27 56.16,22.86 56.16,13.61 56.06,13.51 v56.06,12.9
  Bottom 0.152: 56.16,12.8 v56.06,12.9 56.19,12.75 56.24,12.75 56.74,12.24 70.36,12.24 SV1.11
RDY1
  Top 0.254: U21.5 31.45,12.9 33.27,11.58 33.33,9.63 36.37,9.63 37.39,8.61 R69.1
SCL  (via drill 0.36)
  Top 0.152: v36.75,24.08 39.55,24.08 U1.66
  Top 0.254: R47.1 29.52,9.12 v28.5,10.13 27.23,11.4 U21.2
  Bottom 0.152: 30.53,10.39 30.28,10.13 v28.5,10.13 28.45,10.16 28.35,10.16 28.19,10.31 27.43,10.31 27.43,14.78 36.73,24.08 v36.75,24.08
SD_CD  (via drill 0.36)
  Top 0.152: v86.28,30.43 86.28,24.59 U$18.SW_B | v49.2,30.68 49.2,33.22 U1.34
  Bottom 0.152: v86.28,30.43 67.49,30.43 67.23,30.68 v49.2,30.68
SD_CS  (via drill 0.36)
  Top 0.152: R68.1 85.52,10.21 81.05,14.68 79.32,16.41 77.09,16.41 77.09,16.66 U$18.CD/DAT3 77.09,16.76 75.67,16.76 75.06,17.37 | 75.06,41.96 49.2,41.96 45.8,38.56 45.8,33.33 45.7,33.22 U1.41
  Top 0.178: v84.2,38.41 84.2,26.75 83.74,26.29 83.74,25.83 83.21,25.83 81.38,24 81.38,15.39 81.08,15.09 81.08,14.71 81.05,14.68 | v76.58,39.78 75.06,41.3 75.06,41.91 75.06,41.96
  Bottom 0.178: v84.2,38.41 82.83,39.78 v76.58,39.78
SD_SCK1  (via drill 0.36)
  Top 0.152: U1.76 41.27,17.88 41.27,16.97 v49.96,8.28 | v80.34,17.02 80.39,17.07 78.61,19.05 77.7,19.96 77.09,19.96 U$18.CLK
  Bottom 0.152: v49.96,8.28 50.67,7.57 66.42,7.57 78.69,7.49 v80.34,17.02
SD_SDI1  (via drill 0.36)
  Top 0.152: R66.1 82.98,27.53 77.65,22.2 U$18.DAT0 77.04,22.25 77.04,22.3 75.77,22.3 v75.67,22.4 | v41.07,22.61 U1.69
  Bottom 0.152: v41.07,22.61 41.02,22.4 v75.67,22.4
SD_SDO1  (via drill 0.36)
  Top 0.152: v90.19,15.7 91.26,15.7 R67.1 | v75.67,17.63 77.04,17.63 77.04,17.78 U$18.CMD | U1.70 40.46,22.1 v41.53,21.03 | v59.16,17.93 v61.95,17.93
  Bottom 0.152: v90.19,15.7 88.27,17.63 v75.67,17.63 75.62,17.68 75.36,17.93 61.9,17.98 v61.95,17.93 | v41.53,21.03 44.63,17.93 v59.16,17.93
SD_WP
  Top 0.152: SJ4.2 52.5,36.37 51.79,35.66 51.79,33.33 51.69,33.22 U1.29
SDA  (via drill 0.36)
  Top 0.152: 31.8,9.37 v31.8,9.63 | v38.02,23.32 38.02,23.57 39.55,23.57 U1.67 | v28.04,11.79 27.95,11.7
  Top 0.254: U21.3 27.74,11.91 27.95,11.7 30.28,9.37 31.8,9.37 33.33,7.85 R48.1
  Bottom 0.152: v31.8,9.63 32.05,9.88 | v28.04,11.79 28.04,14.53 35.05,21.54 36.22,21.54 38,23.32 v38.02,23.32
U2RX  (via drill 0.36)
  Top 0.178: U1.19 55.65,28.6 56.01,28.96 56.01,29.34 56.77,30.1 57.45,30.1 v57.68,29.87 | v60.05,29.87 60.66,29.87 60.81,30.02 64.51,30.02 IC5.9
  Bottom 0.178: v57.68,29.87 v60.05,29.87
U2TX  (via drill 0.36)
  Top 0.178: U1.18 55.83,28.09 v56.92,29.18 | v61.27,29.34 62.94,29.34 63.7,28.57 64.59,28.57 IC5.11
  Bottom 0.178: v56.92,29.18 61.04,29.18 v61.27,29.34
USB_N
  Top 0.152: U1.54 32.98,30.1 32.8,30.28 32.54,30.54 32.54,30.57 USB1.2
USB_P
  Top 0.152: U1.55 33.06,29.59 32.58,30.07 32.33,30.32 30.55,30.32 USB1.3
USBID
  Top 0.152: U1.56 31.88,29.11 USB1.4
VBUS
  Top 0.152: USB1.1 30.15,32.46 32.69,32.46 33.45,31.7 39.45,31.7 U1.51
VDD  (via drill 0.36)
  Top 0.152: U1.37 v47.68,34.49 | v43.1,31.95 43.1,33.22 U1.46 | U1.62 v38.28,26.11 | U1.14 v53.26,26.11 | v44.63,16.71 44.63,17.98 U1.83 | v49.71,16.71 49.71,17.98 U1.93
  Top 0.178: v64.62,23.77 64.62,23.78 IC5.16
  Top 0.254: C65.1 24.07,9.52 arc-90 U21.1
  Top 0.813: C65.1 24.07,8.47 26.98,5.56 29.2,5.56 | CIN1.1 20.62,22.58 19.43,23.77 17.32,23.77 +V.2
  Bottom 0.152: C27.1 v47.68,34.49 47.68,34.24 | C28.1 v43.1,31.95 | C29.1 38.53,26.36 38.79,26.11 v38.28,26.11 | 53.52,26.36 v53.26,26.11 C26.1 v51.87,24.61 | C31.1 v44.63,16.71 44.63,17.22 | C32.1 49.71,16.46 49.45,16.71 v49.71,16.71 | v37.62,21.34 37.62,20.27 C30.1
  Bottom 0.178: C37.1 66.38,23.77 v64.62,23.77
  pour Top (rank 3, no thermals): 5.49,27.15 5.61,36.25 9.32,46.43 102.29,46.43 102.29,3.76 100,-0.3 20.02,0.28 19.66,26.49
VSS  (via drill 0.36)
  Top 0.152: v49.45,41.35 50.98,41.35 SJ4.1 | C24.1 v38.02,42.62 | C23.1 v43.36,42.62 | 43.61,33.22 U1.45 | v48.18,31.7 48.18,33.22 U1.36 | v50.72,31.7 50.72,33.22 U1.31 | U$18.GND2 85.47,12.9 87.86,12.9 87.86,13.21 U$18.SW_A 87.35,12.85 v87.35,12.19 | 49.2,17.98 U1.92 49.15,18.03 49.15,19.46 v49.2,20.02 | C25.2 64.95,40.08 v64.95,40.34 | U1.75 38.89,19.61 38.89,18.85 v39.32,18.29 | v45.14,20.02 45.19,19.46 45.19,17.98 U1.84 | v41.07,25.6 U1.63 | v41.07,30.68 40.82,30.63 39.55,30.63 U1.53 | v56.57,25.6 U1.13 | v77.19,14.43 77.19,13.21 U$18.GND3 | v77.19,25.7 77.19,24.54 U$18.GND4 | v84.81,25.76 84.81,24.84 U$18.GND1 | v78.66,21.08 U$18.VSS
  Top 0.178: IC5.1 71.93,25.38 72.77,25.38 73.23,24.92 73.23,24.61 73.46,24.38 v73.46,24.46 | 63.32,27.43 63.25,27.43 63.09,27.28 63.09,27.2 v63.07,27.2 63.4,26.67 IC5.14
  Top 0.254: C65.2 21.36,10.02 U21.10 | v36.88,18.59 39.17,18.44 v39.32,18.29
  Top 0.305: v27.48,3.53 23.67,6.58 22.91,7.34 22.91,8.47 C65.2
  Top 0.61: v62.71,23.57 62.71,24.71 v61.85,25.15
  other vias: 20.73,17.78 19.71,17.78 18.69,17.78 43.36,34.75 18.69,16.76 19.71,16.76 20.73,16.76 21.74,16.76 22.76,16.76 22.76,17.78 21.74,17.78
  pour Bottom (rank 2): 103.56,-1.07 103.68,47.17 9.83,48.72 -2.87,37.29 -0.58,-2.34 37.85,-2.26
  pour Top (rank 2, no thermals): 43.61,33.22 43.61,34.49 44.63,34.49 44.63,43.13 35.74,43.13 35.74,34.75 39.55,34.75 39.55,33.22
  pour Top (rank 2, no thermals): 23.27,20.83 15.65,20.83 15.65,15.49 23.27,15.49
~FAULT1  (via drill 0.36, 0.6)
  Top 0.152: v56.36,27.58 54.79,27.58 U1.17
  Top 0.254: SV1.14 73.91,19.2 | 73.91,19.2 73.91,19.28 | v67.44,19.2 67.44,22.71 v67.44,24.46 | v73.84,19.2 73.91,19.2
  Bottom 0.152: 59.38,24.56 v56.36,27.58
  Bottom 0.254: v73.84,19.2 v67.44,19.2 | v67.44,24.46 59.59,24.46 59.38,24.56
~FAULT2  (via drill 0.36)
  Top 0.152: v46,8.08 35.74,18.34 35.74,27.08 39.55,27.08 U1.60
  Top 0.254: SV1.5 63.78,11.2 63.78,6.86 64.31,6.33 v64.31,6.3
  Bottom 0.152: v46,8.08 49.84,6.07 v64.31,6.3
~SY_FLT1  (via drill 0.6)
  Top 0.254: SV1.12 71.37,20.07 v70.56,20.88 | v52.96,21.26 52.96,21.18 51.97,20.19 50.9,20.19 49.07,22.02 49.07,22.17 43.05,28.19 41.3,28.19 40.69,27.58 39.57,27.58 U1.59
  Bottom 0.254: v70.56,20.88 53.34,20.88 v52.96,21.26
~SY_FLT2  (via drill 0.36)
  Top 0.152: U1.2 54.79,20.07 53.82,20.07 53.82,19.3 53.98,19.15 53.98,13.26 53.77,13.06 v53.77,12.39
  Bottom 0.152: 53.98,12.19 v53.77,12.39 54,12.14 56.34,9.8 64.87,9.8 SV1.7

### Text on the board
tPlace: FAIMS control system / (c) The Tech Toybox 2016,2017